# Altium schematic sheet 5V Buck Boost Converter.SchDoc: 5V DC/DC Buck Boost Converter
size A4; DocumentNumber: 7; SheetNumber: 7; SheetTotal: 54
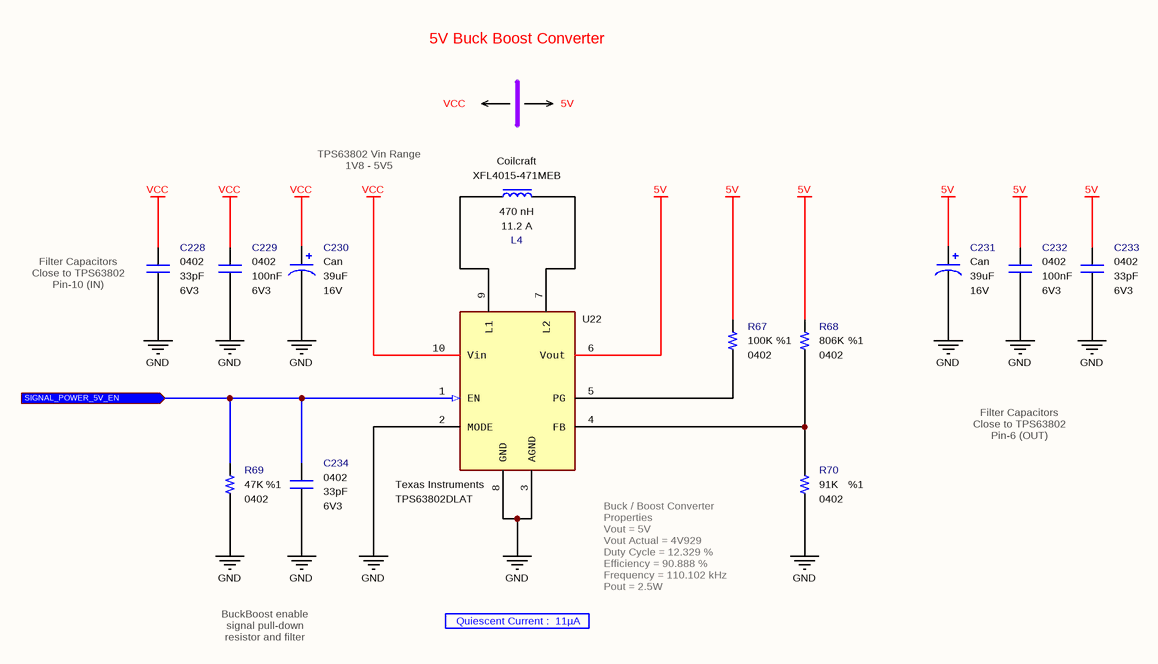
[diagram p0: 5V Buck Boost Converter.SchDoc]

## Parts
C228  value 33pF  Case: 0402  Voltage: 6V3  [CAPACITOR_0402]  (hidden comment: Multilayer Ceramic Capacitor)
C229  value 100nF  Case: 0402  Voltage: 6V3  [CAPACITOR_0402]  (hidden comment: Multilayer Ceramic Capacitor)
C230  value 39uF  Case: Can  Voltage: 16V  [CAPACITOR_CAN-B6]  (hidden comment: Aluminium Organic Polymer Capacitors)
C231  value 39uF  Case: Can  Voltage: 16V  [CAPACITOR_CAN-B6]  (hidden comment: Aluminium Organic Polymer Capacitors)
C232  value 100nF  Case: 0402  Voltage: 6V3  [CAPACITOR_0402]  (hidden comment: Multilayer Ceramic Capacitor)
C233  value 33pF  Case: 0402  Voltage: 6V3  [CAPACITOR_0402]  (hidden comment: Multilayer Ceramic Capacitor)
C234  value 33pF  Case: 0402  Voltage: 6V3  [CAPACITOR_0402]  (hidden comment: Multilayer Ceramic Capacitor)
L4  value 470 nH  Maximum DC Current: 11.2 A  Manufacturer Part Number: XFL4015-471MEB  Manufacturer Name: Coilcraft  [INDUCTOR_XFL4015]  (hidden comment: Fixed Inductor)
R67  value 100K  Tolerance: %1  Case: 0402  [RESISTOR_0402]  (hidden comment: Thick Film Resistor)
R68  value 806K  Tolerance: %1  Case: 0402  [RESISTOR_0402]  (hidden comment: Thick Film Resistor)
R69  value 47K  Tolerance: %1  Case: 0402  [RESISTOR_0402]  (hidden comment: 47K - 0402 - %1 - 1/16W)
R70  value 91K  Tolerance: %1  Case: 0402  [RESISTOR_0402]  (hidden comment: Thick Film Resistor)
U22  Manufacturer Part Number: TPS63802DLAT  Manufacturer Name: Texas Instruments  [VSON-10]  (hidden comment: Buck-Boost Converter)

## Ports
SIGNAL_POWER_5V_EN (in)

## Nets
5V: C231.1 C232.1 C233.2 R67.2 R68.2 U22.6(Vout)
GND: C228.1 C229.2 C230.2 C231.2 C232.2 C233.1 C234.1 R69.1 R70.1 U22.2(MODE) U22.3(AGND) U22.8(GND)
VCC: C228.2 C229.1 C230.1 U22.10(Vin)
SIGNAL_POWER_5V_EN: C234.2 R69.2 U22.1(EN) ; port SIGNAL_POWER_5V_EN
NetL4_1: L4.1 U22.9(L1)
NetL4_2: L4.2 U22.7(L2)
NetR67_1: R67.1 U22.5(PG)
NetR68_1: R68.1 R70.2 U22.4(FB)

## Notes on the sheet
- 5V Buck Boost Converter
- VCC
- 5V
- TPS63802 Vin Range
  1V8 - 5V5
- (near C228) Filter Capacitors
  Close to TPS63802
  Pin-10 (IN)
- Filter Capacitors
  Close to TPS63802
  Pin-6 (OUT)
- BuckBoost enable signal pull-down resistor and filter capacitor.
- Quiescent Current :  11µA
- Buck / Boost Converter Properties
  Vout = 5V
  Vout Actual = 4V929
  Duty Cycle = 12.329 %
  Efficiency = 90.888 %
  Frequency = 110.102 kHz
  Pout = 2.5W
- Engineer
- All Rights are reserved to Customer and Engineer. [2021]
- Size:
- Date:
- A4
- Project :
- Time:
- Sheet
- of
- Customer
- Product ID
- Module ID
- Version
- File:
- Revision

## Library data of the parts
C228 C233 C234 = Capacitor - 33pF [0402-6V3]: Capacitor - 33pF [0402] (Ceramic); Manufacturer Name: Kemet; Manufacturer Part Number: C0402C330J9RACAUTO; Dielectric: X7R; Tolerance: 10%; Height: 0.5mm; Maximum Operating Temperature: +125; Minimum Operating Temperature: -55; ROHS: Yes; ComponentLink1Description: DataSheet; ComponentLink1URL: https://api.kemet.com/component-edge/download/datasheet/C0402C330J9RACAUTO.pdf; ComponentLink2Description: Mouser; ComponentLink2URL: https://www.mouser.com/Search/Refine.aspx?Keyword=80-C0402C330J9RAUTO; Supplier 1: Mouser; Supplier Part Number 1: 80-C0402C330J9RAUTO; Mouser Part Number: 80-C0402C330J9RAUTO
C229 C232 = Capacitor - 100nF [0402-6V3]: Capacitor - 100nF [0402-6V3] (Ceramic); Manufacturer Name: AVX; Manufacturer Part Number: 04026D104KAT4A; Dielectric: X5R; Tolerance: %10; Height: 0.25mm; ComponentLink1Description: Mouser; ComponentLink1URL: https://www.mouser.com.tr/ProductDetail/AVX/04026D104KAT4A?qs=sGAEpiMZZMs0AnBnWHyRQPg4iYkCw7IMED%2F4kpqgf7w%3D; ComponentLink2Description: DataSheet; ComponentLink2URL: https://www.mouser.com.tr/datasheet/2/40/cx5r-776519.pdf; ROHS: Yes; Maximum Operating Temperature: +85; Minimum Operating Temperature: -55; Supplier 1: Avnet; Supplier Part Number 1: 04026D104KAT4A; Mouser Part Number: 581-04026D104KAT4A
C230 C231 = Capacitor - 39uF [Can-16V]: Capacitor - 39uF 16V [Can] (Electrolytic); Manufacturer Name: Panasonic; Manufacturer Part Number: 16SVPC39MV; Leakage Current: 300uA; Tolerance: 20%; ESR: 27 mOhms; Height: 6mm; Maximum Operating Temperature: +105; Minimum Operating Temperature: -55; ROHS: Yes; ComponentLink1Description: DataSheet; ComponentLink1URL: https://www.mouser.com.tr/datasheet/2/315/SVPC_OS-1197065.pdf; ComponentLink2Description: Mouser; ComponentLink2URL: https://www.mouser.com.tr/ProductDetail/Panasonic/16SVPC39MV?qs=%2Fha2pyFadujpu3ATUg5hwJ6EWbTfmGGWJDu5kzoHUqwaZzNIr7t5GA%3D%3D; Supplier 1: Mouser; Supplier 2: Digi-Key; Supplier Part Number 2: P16473CT-ND; Supplier Part Number 1: 667-16SVPC39MV; Mouser Part Number: 667-16SVPC39MV
L4 = Inductor - 470 nH [SMD]: Fixed Inductors 0.47uH 20% 11.2A 8.36mOhms AEC-Q200; Height: 1.6mm; ComponentLink1Description: DataSheet; ComponentLink1URL: https://eu.mouser.com/datasheet/2/597/xfl4015-270755.pdf; ComponentLink2Description: Mouser; ComponentLink2URL: https://eu.mouser.com/ProductDetail/Coilcraft/XFL4015-471MEB?qs=VJjuEbE9QBO6UaDdUAgr%252Bw%3D%3D; Maximum DC Resistance: 8.36 mOhms; Maximum Operating Temperature: +125; Minimum Operating Temperature: -40; Tolerance: 20%; Supplier 1: Mouser; Supplier 2: Farnell; Supplier 3: Farnell; Supplier Part Number 1: 994-XFL4015-471MEB; Supplier Part Number 2: 2289211; Supplier Part Number 3: 2289211RL; Case: XFL4015
R67 = Resistor - 100K: Thick Film Resistors - SMD 1/16 W 100 Kohms 1%; Manufacturer Name: Vishay; Manufacturer Part Number: CRCW0402100KFKED; Height: 0.35mm; ComponentLink1Description: DataSheet; ComponentLink1URL: https://www.mouser.com.tr/datasheet/2/427/dcrcwe3-1762152.pdf; ComponentLink2Description: Mouser; ComponentLink2URL: https://eu.mouser.com/ProductDetail/Vishay-Dale/CRCW0402100KFKED?qs=OlqPY1CiralZGKRwQ4Glcg%3D%3D; Supplier 1: Future Electronics; Supplier 2: Future Electronics; Supplier 3: Arrow; Supplier 4: Farnell; Supplier 5: Digi-Key; Supplier Part Number 1: CRCW0402100KFKED-CUTT; Supplier Part Number 2: CRCW0402100KFKED-REEL; Supplier Part Number 3: CRCW0402100KFKED; Supplier Part Number 4: 2121857; Supplier Part Number 5: 541-100KLCT-ND; Mouser Part Number: 71-CRCW0402-100K-E3
R68 = Resistor - 806K: Thick Film Resistors - SMD 1/16 W 806 Kohms 1%; Manufacturer Name: Vishay; Manufacturer Part Number: CRCW0402806KFKED; Height: 0.35mm; ComponentLink1Description: DataSheet; ComponentLink1URL: https://www.mouser.com.tr/datasheet/2/427/dcrcwe3-1762152.pdf; ComponentLink2Description: Mouser; ComponentLink2URL: https://www.mouser.com.tr/ProductDetail/Vishay-Dale/CRCW0402806KFKED/?qs=cra7cYzOg1xpxTzRs9o4Mw%3D%3D; Supplier 1: Avnet; Supplier 2: Future Electronics; Supplier 3: Future Electronics; Supplier 4: Mouser; Supplier 5: Farnell; Supplier 6: Newark; Supplier 7: Digi-Key; Supplier 8: Digi-Key; Supplier 9: Newark; Supplier 10: Digi-Key; Supplier Part Number 1: CRCW0402806KFKED; Supplier Part Number 2: 7425135; Supplier Part Number 3: 9019379; Supplier Part Number 4: 71-CRCW0402-806K-E3; Supplier Part Number 5: 2141028; Supplier Part Number 6: 52K7299; Supplier Part Number 7: 541-806KLCT-ND; Supplier Part Number 8: 541-806KLDKR-ND; Supplier Part Number 9: 26W9212; Supplier Part Number 10: 541-806KLTR-ND; Mouser Part Number: 71-CRCW0402-806K-E3
R69 = Resistor - 47K: Thick Film Resistors - SMD 1/16 W 47 Kohms 1%; Manufacturer Name: Vishay; Manufacturer Part Number: CRCW040247K0FKED; Height: 0.4mm; ComponentLink1Description: DataSheet; ComponentLink1URL: https://www.mouser.com.tr/datasheet/2/427/dcrcwe3-1762152.pdf; ComponentLink2Description: Mouser; ComponentLink2URL: https://www.mouser.com.tr/ProductDetail/Vishay-Dale/CRCW040247K0FKED?qs=sGAEpiMZZMu61qfTUdNhG2DpbjADlD3GL%252B3h1elTxqU%3D; Supplier 1: RSComponents; Supplier 2: Newark; Supplier Part Number 1: 6789361P; Supplier Part Number 2: 52K7097; Supplier 3: Avnet; Supplier 4: RSComponents; Supplier 5: Future Electronics; Supplier 6: Future Electronics; Supplier 7: Newark; Supplier 8: Arrow Electronics; Supplier 9: Mouser; Supplier 10: Newark; Supplier 11: Avnet; Supplier 12: Digi-Key; Supplier 13: Digi-Key; Supplier 14: Digi-Key; Supplier 15: Newark; Supplier 16: Farnell; Supplier 17: Farnell; Supplier 18: Farnell; Supplier 19: Allied Electronics; Supplier 20: Allied Electronics; Supplier 21: Avnet; Supplier 22: Future Electronics; Supplier 23: Future Electronics; Supplier 24: Future Electronics; Supplier 25: Newark; Supplier 26: RSComponents; Supplier 27: RSComponents; Supplier Part Number 3: 52K7097; Supplier Part Number 4: 6789361; Supplier Part Number 5: 2103738; Supplier Part Number 6: 7521222; Supplier Part Number 7: 42K3500; Supplier Part Number 8: CRCW040247K0FKED; Supplier Part Number 12: 541-47.0KLCT-ND; Supplier Part Number 14: 541-47.0KLTR-ND; Supplier Part Number 10: 61M5310; Supplier Part Number 9: 71-CRCW0402-47K-E3; Supplier Part Number 13: 541-47.0KLDKR-ND; Supplier Part Number 11: CRCW040247K0FKED; Supplier Part Number 15: 25AC7165; Supplier Part Number 16: 1469719; Supplier Part Number 18: 2121814; Supplier Part Number 17: 1469719RL; Supplier Part Number 19: 70202660; Supplier Part Number 20: 70272767; Supplier Part Number 21: 42K3500; Supplier Part Number 22: 6128776; Supplier Part Number 24: CRCW040247K0FKED-REEL; Supplier Part Number 23: CRCW040247K0FKED-CUTT; Supplier Part Number 25: 24W2315; Supplier Part Number 26: 1688455; Supplier Part Number 27: 1823505
R70 = Resistor - 91K: Thick Film Resistors - SMD 1/16 W 91 Kohms 1%; Manufacturer Name: Vishay; Manufacturer Part Number: CRCW040291K0FKED; Height: 0.35mm; ComponentLink1Description: DataSheet; ComponentLink1URL: https://eu.mouser.com/datasheet/2/427/dcrcwe3-1762152.pdf; ComponentLink2Description: Mouser; ComponentLink2URL: https://eu.mouser.com/ProductDetail/Vishay-Dale/CRCW040291K0FKED?qs=Po1ctqG%2F82oNfd9H7rZeFQ%3D%3D; Supplier 1: Future Electronics; Supplier 2: Arrow; Supplier 3: Farnell; Supplier 4: Newark; Supplier 5: Digi-Key; Supplier Part Number 1: CRCW040291K0FKED-REEL; Supplier Part Number 2: CRCW040291K0FKED; Supplier Part Number 3: 2121853; Supplier Part Number 4: 24W2519; Supplier Part Number 5: 541-91.0KLCT-ND; Mouser Part Number: 71-CRCW040291K0FKED
U22 = IC - TPS63802DLAT: Switching Voltage Regulators High current, high efficiency single inductor buck-boost converter 10-VSON-HR -40 to 125; ComponentLink1Description: DataSheet; ComponentLink1URL: https://www.ti.com/lit/ds/symlink/tps63802.pdf?ts=1611132560608&ref_url=https%253A%252F%252Fwww.google.com%252F; ComponentLink2Description: Mouser; ComponentLink2URL: https://www.mouser.com.tr/ProductDetail/Maxim-Integrated/MAX17055ETB%2bT?qs=sGAEpiMZZMve4%2FbfQkoj%252BAs6FTSsQJaJrD7Z3v0Qe9M%3D; Minimum Operating Temperature: -40; Maximum Operating Temperature: +125; Supplier 1: Avnet; Supplier 2: Mouser; Supplier 3: Digi-Key; Supplier Part Number 1: TPS63802DLAT; Supplier Part Number 2: 595-TPS63802DLAT; Supplier Part Number 3: 296-TPS63802DLATCT-ND; Case: VSON-10; ComponentLink3Description: Product Page; ComponentLink3URL: https://www.ti.com/store/ti/en/p/product/?p=TPS63802DLAT; Mouser Part Number: 595-TPS63802DLAT